# Altium schematic sheet GENERATOR CONTROL BOARD.SchDoc
size A1
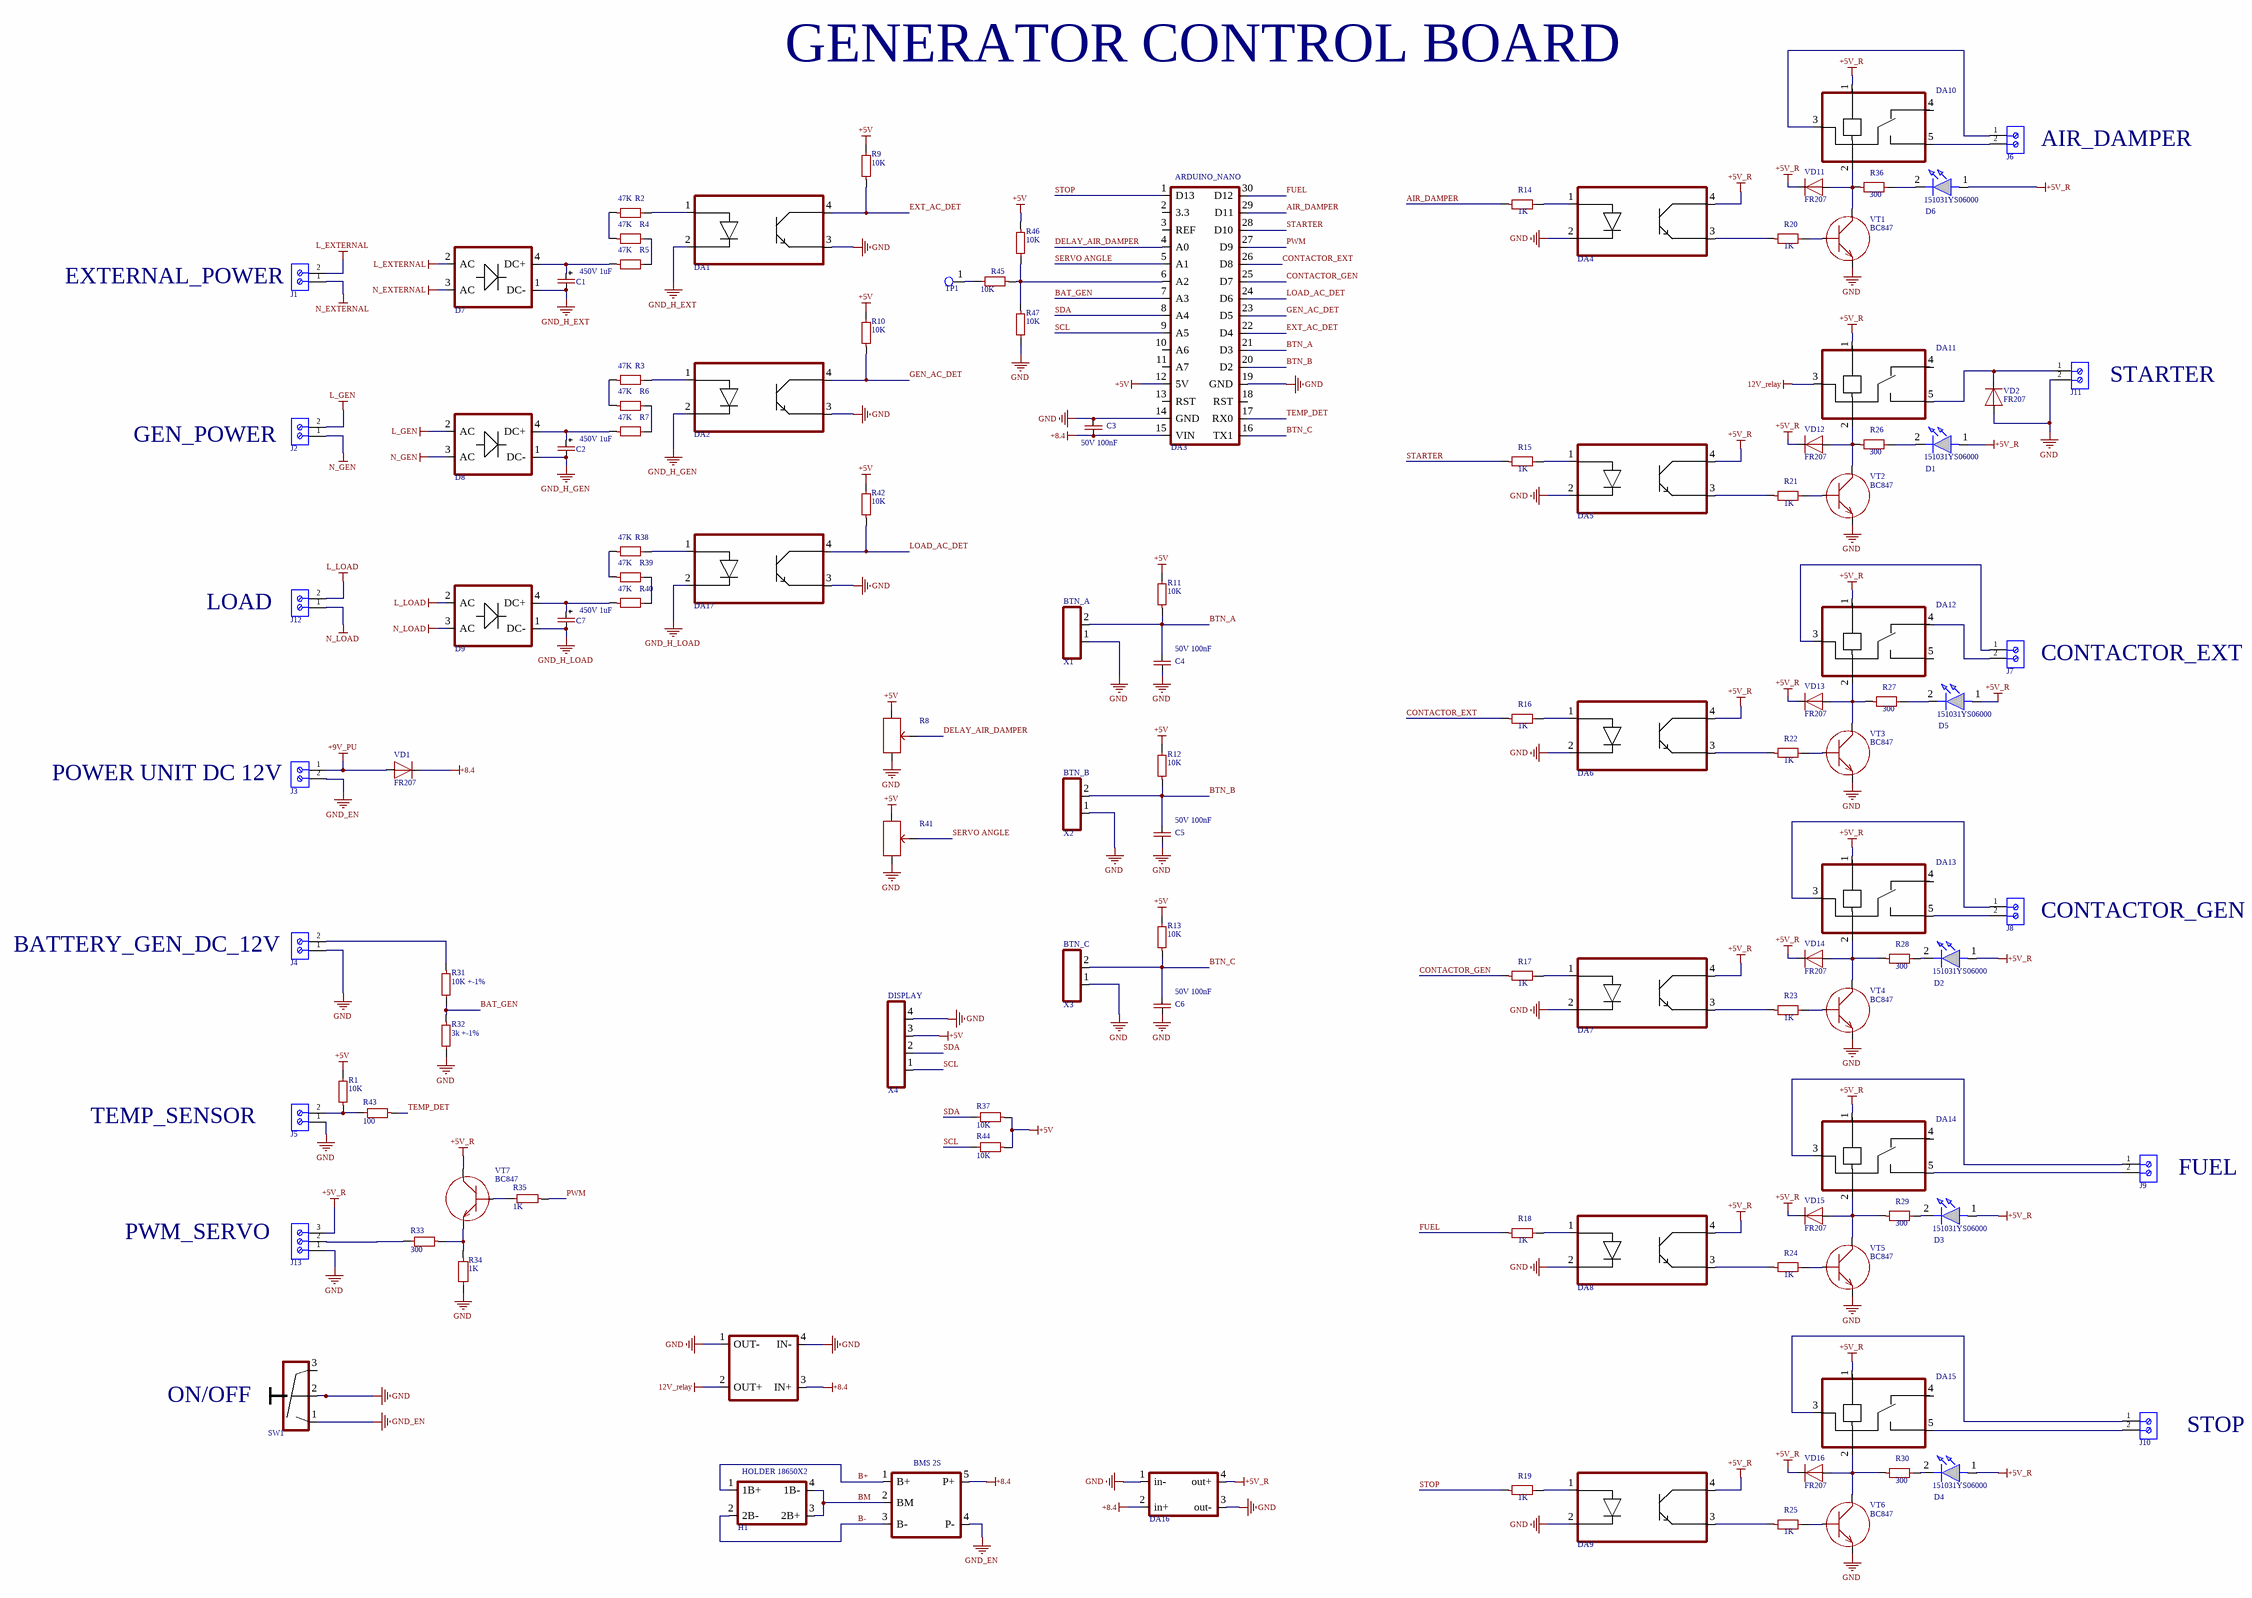
[diagram p0: GENERATOR CONTROL BOARD.SchDoc]

## Parts
(Parts that share a designator on the sheet are numbered #1, #2 ... from top to bottom, then left to right.)
?#1  XL6009  [XL6009]  (value not drawn)
?#2  BMS 2S  [BMS 2S]
C1  450V 1uF  [CAPPOL-12x25]
C2  450V 1uF  [CAPPOL-12x25]
C3  50V 100nF  [CAP-0805]
C4  50V 100nF  [CAP-0805]
C5  50V 100nF  [CAP-0805]
C6  50V 100nF  [CAP-0805]
C7  450V 1uF  [CAPPOL-12x25]
D1  151031YS06000  [Type 3mm]
D2  151031YS06000  [Type 3mm]
D3  151031YS06000  [Type 3mm]
D4  151031YS06000  [Type 3mm]
D5  151031YS06000  [Type 3mm]
D6  151031YS06000  [Type 3mm]
D7  RS40X  [RS40X]  (value not drawn)
D8  RS40X  [RS40X]  (value not drawn)
D9  RS40X  [RS40X]  (value not drawn)
DA1  PC817  [4-SMD]  (value not drawn)
DA2  PC817  [4-SMD]  (value not drawn)
DA3  ARDUINO_NANO  [ARDUINO_NANO]
DA4  PC817  [4-SMD]  (value not drawn)
DA5  PC817  [4-SMD]  (value not drawn)
DA6  PC817  [4-SMD]  (value not drawn)
DA7  PC817  [4-SMD]  (value not drawn)
DA8  PC817  [4-SMD]  (value not drawn)
DA9  PC817  [4-SMD]  (value not drawn)
DA10  SRD-05VDC  [SRD-05VDC]  (value not drawn)
DA11  SRD-05VDC  [SRD-05VDC]  (value not drawn)
DA12  SRD-05VDC  [SRD-05VDC]  (value not drawn)
DA13  SRD-05VDC  [SRD-05VDC]  (value not drawn)
DA14  SRD-05VDC  [SRD-05VDC]  (value not drawn)
DA15  SRD-05VDC  [SRD-05VDC]  (value not drawn)
DA16  mini-360  [mini-360]  (value not drawn)
DA17  PC817  [4-SMD]  (value not drawn)
H1  HOLDER 18650X2  [HOLDER 18650X2]
J1  691101710002  [691101710002]  (value not drawn)
J2  691101710002  [691101710002]  (value not drawn)
J3  691101710002  [691101710002]  (value not drawn)
J4  691101710002  [691101710002]  (value not drawn)
J5  691101710002  [691101710002]  (value not drawn)
J6  691101710002  [691101710002]  (value not drawn)
J7  691101710002  [691101710002]  (value not drawn)
J8  691101710002  [691101710002]  (value not drawn)
J9  691101710002  [691101710002]  (value not drawn)
J10  691101710002  [691101710002]  (value not drawn)
J11  691101710002  [691101710002]  (value not drawn)
J12  691101710002  [691101710002]  (value not drawn)
J13  691101710003  [691101710003]  (value not drawn)
R1  10K  [RES-0805]
R2  47K  [RES-1206]
R3  47K  [RES-1206]
R4  47K  [RES-1206]
R5  47K  [RES-1206]
R6  47K  [RES-1206]
R7  47K  [RES-1206]
R8  RES  [SF063]  (value not drawn)
R9  10K  [RES-0805]
R10  10K  [RES-0805]
R11  10K  [RES-0805]
R12  10K  [RES-0805]
R13  10K  [RES-0805]
R14  1K  [RES-0805]
R15  1K  [RES-0805]
R16  1K  [RES-0805]
R17  1K  [RES-0805]
R18  1K  [RES-0805]
R19  1K  [RES-0805]
R20  1K  [RES-0805]
R21  1K  [RES-0805]
R22  1K  [RES-0805]
R23  1K  [RES-0805]
R24  1K  [RES-0805]
R25  1K  [RES-0805]
R26  300  [RES-0805]
R27  300  [RES-0805]
R28  300  [RES-0805]
R29  300  [RES-0805]
R30  300  [RES-0805]
R31  10K +-1%  [RES-0805]
R32  3k +-1%  [RES-0805]
R33  300  [RES-0805]
R34  1K  [RES-0805]
R35  1K  [RES-0805]
R36  300  [RES-0805]
R37  10K  [RES-0805]
R38  47K  [RES-1206]
R39  47K  [RES-1206]
R40  47K  [RES-1206]
R41  RES  [SF063]  (value not drawn)
R42  10K  [RES-0805]
R43  100  [RES-0805]
R44  10K  [RES-0805]
R45  10K  [RES-0805]
R46  10K  [RES-0805]
R47  10K  [RES-0805]
SW1  KCD1-101  [KCD1-101]  (value not drawn)
TP1  Test_Point_PCB  [Test_Point]  (value not drawn)
VD1  FR207  [FR207]
VD2  FR207  [FR207]
VD11  FR207  [FR207]
VD12  FR207  [FR207]
VD13  FR207  [FR207]
VD14  FR207  [FR207]
VD15  FR207  [FR207]
VD16  FR207  [FR207]
VT1  BC847  [SOT23-3]
VT2  BC847  [SOT23-3]
VT3  BC847  [SOT23-3]
VT4  BC847  [SOT23-3]
VT5  BC847  [SOT23-3]
VT6  BC847  [SOT23-3]
VT7  BC847  [SOT23-3]
X1  BTN_A  [CONN-PLS-2-2.54mm]
X2  BTN_B  [CONN-PLS-2-2.54mm]
X3  BTN_C  [CONN-PLS-2-2.54mm]
X4  DISPLAY  [CONN-PLS-4-2.54mm]

## Nets
12V_relay: ?#1.2(OUT+) DA11.3(EMITTER)
+5V: DA3.12(5V) R1.2 R8.2 R9.2 R10.2 R11.2 R12.2 R13.2 R37.1 R41.2 R42.2 R44.1 R46.1 X4.3
+5V_R: D1.1(A) D2.1(A) D3.1(A) D4.1(A) D5.1(A) D6.1(A) DA4.4(COLLECTOR) DA5.4(COLLECTOR) DA6.4(COLLECTOR) DA7.4(COLLECTOR) DA8.4(COLLECTOR) DA9.4(COLLECTOR) DA10.1(ANODE) DA11.1(ANODE) DA12.1(ANODE) DA13.1(ANODE) DA14.1(ANODE) DA15.1(ANODE) DA16.4(out+) J13.3 VD11.1(C) VD12.1(C) VD13.1(C) VD14.1(C) VD15.1(C) VD16.1(C) VT7.3(C)
+8.4: ?#1.3(IN+) ?#2.5(P+) C3.1 DA3.15(VIN) DA16.2(in+) VD1.1(C)
+9V_PU: J3.1 VD1.2(A)
GND: ?#1.1(OUT-) ?#1.4(IN-) C3.2 C4.1 C5.1 C6.1 DA1.3(EMITTER) DA2.3(EMITTER) DA3.14(GND) DA3.19(GND) DA4.2(CATHODE) DA5.2(CATHODE) DA6.2(CATHODE) DA7.2(CATHODE) DA8.2(CATHODE) DA9.2(CATHODE) DA16.1(in-) DA16.3(out-) DA17.3(EMITTER) J4.1 J5.1 J11.2 J13.1 R8.1 R32.2 R34.2 R41.1 R47.2 SW1.2(OUT+) VD2.2(A) VT1.2(E) VT2.2(E) VT3.2(E) VT4.2(E) VT5.2(E) VT6.2(E) X1.1 X2.1 X3.1 X4.4
GND_EN: ?#2.4(P-) J3.2 SW1.1(OUT-)
GND_H_EXT: C1.2(-) D7.1(DC-) DA1.2(CATHODE)
GND_H_GEN: C2.2(-) D8.1(DC-) DA2.2(CATHODE)
GND_H_LOAD: C7.2(-) D9.1(DC-) DA17.2(CATHODE)
L_EXTERNAL: D7.2(AC) J1.2
L_GEN: D8.2(AC) J2.2
L_LOAD: D9.2(AC) J12.2
N_EXTERNAL: D7.3(AC) J1.1
N_GEN: D8.3(AC) J2.1
N_LOAD: D9.3(AC) J12.1
AIR_DAMPER: DA3.29(D11) R14.1
B+: ?#2.1(B+) H1.1(1B+)
B-: ?#2.3(B-) H1.2(2B-)
BAT_GEN: DA3.7(A3) R31.2 R32.1
BM: ?#2.2(BM) H1.3(2B+) H1.4(1B-)
BTN_A: C4.2 DA3.21(D3) R11.1 X1.2
BTN_B: C5.2 DA3.20(D2) R12.1 X2.2
BTN_C: C6.2 DA3.16(TX1) R13.1 X3.2
CONTACTOR_EXT: DA3.26(D8) R16.1
CONTACTOR_GEN: DA3.25(D7) R17.1
DELAY_AIR_DAMPER: DA3.4(A0) R8.3
EXT_AC_DET: DA1.4(COLLECTOR) DA3.22(D4) R9.1
FUEL: DA3.30(D12) R18.1
GEN_AC_DET: DA2.4(COLLECTOR) DA3.23(D5) R10.1
LOAD_AC_DET: DA3.24(D6) DA17.4(COLLECTOR) R42.1
PWM: DA3.27(D9) R35.1
SCL: DA3.9(A5) R44.2 X4.1
SDA: DA3.8(A4) R37.2 X4.2
SERVO ANGLE: DA3.5(A1) R41.3
STARTER: DA3.28(D10) R15.1
STOP: DA3.1(D13) R19.1
TEMP_DET: DA3.17(RX0) R43.1
NetC1_1: C1.1(+) D7.4(DC+) R5.1
NetC2_1: C2.1(+) D8.4(DC+) R7.1
NetC7_1: C7.1(+) D9.4(DC+) R40.1
NetD1_2: D1.2(K) R26.2
NetD2_2: D2.2(K) R28.2
NetD3_2: D3.2(K) R29.2
NetD4_2: D4.2(K) R30.2
NetD5_2: D5.2(K) R27.2
NetD6_2: D6.2(K) R36.2
NetDA1_1: DA1.1(ANODE) R2.2
NetDA2_1: DA2.1(ANODE) R3.2
NetDA3_6: DA3.6(A2) R45.1 R46.2 R47.1
NetDA4_1: DA4.1(ANODE) R14.2
NetDA4_3: DA4.3(EMITTER) R20.1
NetDA5_1: DA5.1(ANODE) R15.2
NetDA5_3: DA5.3(EMITTER) R21.1
NetDA6_1: DA6.1(ANODE) R16.2
NetDA6_3: DA6.3(EMITTER) R22.1
NetDA7_1: DA7.1(ANODE) R17.2
NetDA7_3: DA7.3(EMITTER) R23.1
NetDA8_1: DA8.1(ANODE) R18.2
NetDA8_3: DA8.3(EMITTER) R24.1
NetDA9_1: DA9.1(ANODE) R19.2
NetDA9_3: DA9.3(EMITTER) R25.1
NetDA10_2: DA10.2(CATHODE) R36.1 VD11.2(A) VT1.3(C)
NetDA10_3: DA10.3(EMITTER) J6.1
NetDA10_5: DA10.5(COLLECTOR) J6.2
NetDA11_2: DA11.2(CATHODE) R26.1 VD12.2(A) VT2.3(C)
NetDA11_5: DA11.5(COLLECTOR) J11.1 VD2.1(C)
NetDA12_2: DA12.2(CATHODE) R27.1 VD13.2(A) VT3.3(C)
NetDA12_3: DA12.3(EMITTER) J7.1
NetDA12_4: DA12.4(COLLECTOR) J7.2
NetDA13_2: DA13.2(CATHODE) R28.1 VD14.2(A) VT4.3(C)
NetDA13_3: DA13.3(EMITTER) J8.1
NetDA13_5: DA13.5(COLLECTOR) J8.2
NetDA14_2: DA14.2(CATHODE) R29.1 VD15.2(A) VT5.3(C)
NetDA14_3: DA14.3(EMITTER) J9.1
NetDA14_5: DA14.5(COLLECTOR) J9.2
NetDA15_2: DA15.2(CATHODE) R30.1 VD16.2(A) VT6.3(C)
NetDA15_3: DA15.3(EMITTER) J10.1
NetDA15_5: DA15.5(COLLECTOR) J10.2
NetDA17_1: DA17.1(ANODE) R38.2
NetJ4_2: J4.2 R31.1
NetJ5_2: J5.2 R1.1 R43.2
NetJ13_2: J13.2 R33.2
NetR2_1: R2.1 R4.1
NetR3_1: R3.1 R6.1
NetR4_2: R4.2 R5.2
NetR6_2: R6.2 R7.2
NetR20_2: R20.2 VT1.1(B)
NetR21_2: R21.2 VT2.1(B)
NetR22_2: R22.2 VT3.1(B)
NetR23_2: R23.2 VT4.1(B)
NetR24_2: R24.2 VT5.1(B)
NetR25_2: R25.2 VT6.1(B)
NetR33_1: R33.1 R34.1 VT7.2(E)
NetR35_2: R35.2 VT7.1(B)
NetR38_1: R38.1 R39.1
NetR39_2: R39.2 R40.2
NetR45_2: R45.2 TP1.1(G9)

Not connected (* = marked no-connect by the designer): DA3 2(3.3) 3(REF) 10(A6) 11(A7) 13(RST) 18(RST); DA10 4(COLLECTOR); DA11 4(COLLECTOR); DA12 5(COLLECTOR); DA13 4(COLLECTOR); DA14 4(COLLECTOR); DA15 4(COLLECTOR); SW1 3(IN+)

## Notes on the sheet
- GENERATOR CONTROL BOARD
- (near J6) AIR_DAMPER
- EXTERNAL_POWER
- STARTER
- GEN_POWER
- LOAD
- (near J7) CONTACTOR_EXT
- POWER UNIT DC 12V
- BATTERY_GEN_DC_12V
- (near J8) CONTACTOR_GEN
- TEMP_SENSOR
- FUEL
- PWM_SERVO
- ON/OFF
- STOP

## Library data of the parts
C1 C2 C7 = CAP-POLAR
C3-C6 = CAP-NON-POLAR
D1-D6 = 151031YS06000: WURTH ELEKTRONIK - 151031YS06000 - LED, Yellow, Through Hole, T-1 (3mm), 30 mA, 2 V, 590 nm; Geometry.Height: 5.5mm; Manufacturer_Name: Wurth Elektronik; Manufacturer_Part_Number: 151031YS06000; Mouser Part Number: 710-151031YS06000; Mouser Price/Stock: https://www.mouser.co.uk/ProductDetail/Wurth-Elektronik/151031YS06000?qs=LlUlMxKIyB3xSYYW%252BcuBiQ%3D%3D; Arrow Part Number: *; Arrow Price/Stock: *; Mouser Testing Part Number: *; Mouser Testing Price/Stock: *; Datasheet Link: https://katalog.we-online.de/led/datasheet/151031YS06000.pdf
J1-J12 = 691101710002: WR-TBL Series 101 Horizontal Entry Modular, THT, pitch 5mm, 2p; Manufacturer: Wurth Elektronik; Modularity: Yes; Rated Current: 16A; Working Voltage: 250V; ComponentLink1Description: Website Link; ComponentLink1URL: https://www.we-online.com/redexpert/article/691101710002?ad; ComponentLink2Description: Datasheet Link; ComponentLink2URL: https://www.we-online.com/redexpert/spec/691101710002?ad; Manufacturer Part Number: 691101710002; Category: Terminal Blocks; Match Code: WR-TBL; Mount: Through Hole; Operating Temperature Max: 105°C; Operating Temperature Min: -40°C; Packaging: Box; Application: Pressure Clamp; Number of Pins: 2; Number of Rows: 1; Orientation: Horizontal; Pitch: 5mm
J13 = 691101710003: WR-TBL Series 101 Horizontal Entry Modular, THT, pitch 5mm, 3p; Manufacturer: Wurth Elektronik; Modularity: Yes; Rated Current: 16A; Working Voltage: 250V; ComponentLink1Description: Website Link; ComponentLink1URL: https://www.we-online.com/redexpert/article/691101710003?ad; ComponentLink2Description: Datasheet Link; ComponentLink2URL: https://www.we-online.com/redexpert/spec/691101710003?ad; Manufacturer Part Number: 691101710003; Category: Terminal Blocks; Match Code: WR-TBL; Mount: Through Hole; Operating Temperature Max: 105°C; Operating Temperature Min: -40°C; Packaging: Box; Application: Pressure Clamp; Number of Pins: 3; Number of Rows: 1; Orientation: Horizontal; Pitch: 5mm
R1-R7 R9-R40 R42-R47 = RES-CONST
TP1 = TP_PCB?: Test_Point
VD1 VD2 VD11-VD16 = DIODE
VT1-VT7 = BC847-BEC
X1-X3 = PLS-2: 2-pin PLS Connector 2.54 mm pitch (X-00029); Part Number: PLS-2; ID: X-00067; Value: PLS-2; In Stock: 0; ComponentLink1Description: Database URL; ComponentLink1URL: http://el.udtech.dev/component/1048/detail
X4 = PLS-4: 4-pin PLS Connector 2.54 mm pitch; Part Number: PLS-4; ID: X-00003; Value: PLS-4; In Stock: 50; ComponentLink1Description: Database URL; ComponentLink1URL: http://el.udtech.dev/component/23/detail